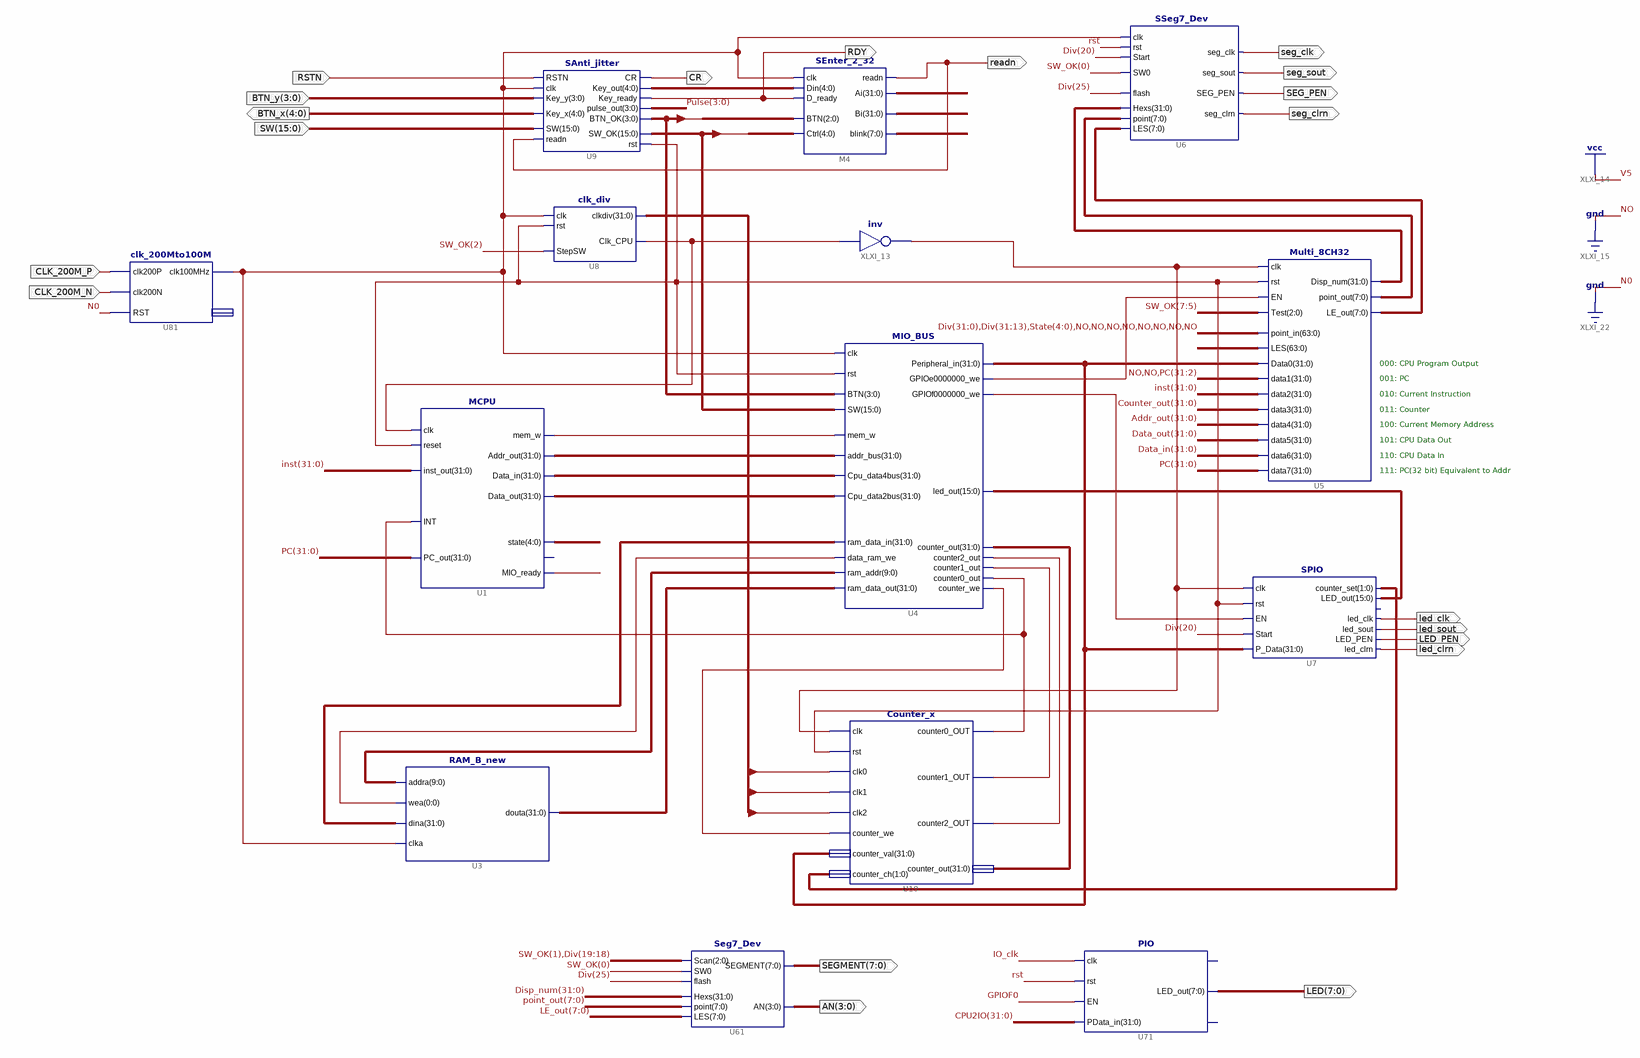
[diagram p0: schematic sheet 1]
// Xilinx ISE schematic Top_OExp09_IP2MCPU.sch (kintex7) as structural Verilog: 14 symbols, 20 ports
module Top_OExp09_IP2MCPU (
  input  RSTN,
  input  [3:0] BTN_y,
  input  [15:0] SW,
  input  CLK_200M_P,
  input  CLK_200M_N,
  output [4:0] BTN_x,
  output readn,
  output CR,
  output RDY,
  output seg_clk,
  output seg_sout,
  output SEG_PEN,
  output seg_clrn,
  output led_clk,
  output led_sout,
  output LED_PEN,
  output led_clrn,
  output [7:0] LED,
  output [7:0] SEGMENT,
  output [3:0] AN
);

  wire clk_100mhz, Clk_CPU, GPIOF0, IO_clk, rst, XLXN_54, XLXN_71, XLXN_81, XLXN_88, XLXN_92, XLXN_93;
  wire [0:0] XLXN_86;
  wire [1:0] XLXN_98;
  wire [3:0] BTN_OK, Pulse;
  wire [4:0] State, XLXN_14;
  wire [7:0] blink, LE_out, point_out;
  wire [9:0] XLXN_85;
  wire [15:0] LED_out, SW_OK;
  wire [31:0] Addr_out, Ai, Bi, Counter_out, CPU2IO, Data_in, Data_out, Disp_num, Div, inst, PC, XLXN_82,
       XLXN_87;

  Counter_x U10 (
    .clk(IO_clk), .rst(rst), .clk0(Div[8]), .clk1(Div[9]), .clk2(Div[11]), .counter_we(XLXN_88),
    .counter_val(CPU2IO), .counter_ch(XLXN_98), .counter0_OUT(XLXN_81), .counter1_OUT(XLXN_93),
    .counter2_OUT(XLXN_92), .counter_out(Counter_out));
  MCPU U1 (
    .Data_in(Data_in), .clk(Clk_CPU), .reset(rst), .MIO_ready(1'b1), .INT(XLXN_81), .state(State),
    .mem_w(XLXN_71), .inst_out(inst), .PC_out(PC), .Data_out(Data_out), .Addr_out(Addr_out));  // open: CPU_MIO
  MIO_BUS U4 (
    .rst(rst), .clk(clk_100mhz), .mem_w(XLXN_71), .addr_bus(Addr_out), .Cpu_data4bus(Data_in),
    .Cpu_data2bus(Data_out), .ram_data_out(XLXN_82), .ram_addr(XLXN_85), .data_ram_we(XLXN_86[0]),
    .ram_data_in(XLXN_87), .counter_out(Counter_out), .counter2_out(XLXN_92), .counter1_out(XLXN_93),
    .counter0_out(XLXN_81), .counter_we(XLXN_88), .BTN(BTN_OK), .SW(SW_OK), .led_out(LED_out),
    .Peripheral_in(CPU2IO), .GPIOe0000000_we(XLXN_54), .GPIOf0000000_we(GPIOF0));
  Multi_8CH32 U5 (
    .Test(SW_OK[7:5]), .point_in({Div, Div[31:13], State, {8{1'b0}}}), .EN(XLXN_54), .clk(IO_clk), .rst(rst),
    .LES({64{1'b0}}), .Data0(CPU2IO), .data1({2'b00, PC[31:2]}), .data2(inst), .data3(Counter_out),
    .data4(Addr_out), .data5(Data_out), .data6(Data_in), .data7(PC), .point_out(point_out), .LE_out(LE_out),
    .Disp_num(Disp_num));
  SAnti_jitter U9 (
    .SW(SW), .readn(readn), .Key_y(BTN_y), .Key_x(BTN_x), .RSTN(RSTN), .clk(clk_100mhz), .Key_out(XLXN_14),
    .Key_ready(RDY), .CR(CR), .rst(rst), .SW_OK(SW_OK), .pulse_out(Pulse), .BTN_OK(BTN_OK));
  clk_div U8 (.clk(clk_100mhz), .rst(rst), .Clk_CPU(Clk_CPU), .clkdiv(Div), .StepSW(SW_OK[2]));
  SEnter_2_32 M4 (
    .readn(readn), .Ai(Ai), .Bi(Bi), .blink(blink), .Din(XLXN_14), .D_ready(RDY), .clk(clk_100mhz),
    .Ctrl({SW_OK[7:5], SW_OK[15], SW_OK[0]}), .BTN(BTN_OK[2:0]));
  Seg7_Dev U61 (
    .LES(LE_out), .Scan({SW_OK[1], Div[19:18]}), .SEGMENT(SEGMENT), .AN(AN), .point(point_out),
    .flash(Div[25]), .SW0(SW_OK[0]), .Hexs(Disp_num));
  PIO U71 (.clk(IO_clk), .rst(rst), .EN(GPIOF0), .PData_in(CPU2IO), .LED_out(LED));  // open: GPIOf0, counter_set
  SSeg7_Dev U6 (
    .LES(LE_out), .SEG_PEN(SEG_PEN), .seg_sout(seg_sout), .seg_clrn(seg_clrn), .point(point_out),
    .Hexs(Disp_num), .SW0(SW_OK[0]), .flash(Div[25]), .seg_clk(seg_clk), .clk(clk_100mhz), .rst(rst),
    .Start(Div[20]));
  SPIO U7 (
    .clk(IO_clk), .P_Data(CPU2IO), .rst(rst), .EN(GPIOF0), .Start(Div[20]), .led_clk(led_clk),
    .LED_out(LED_out), .counter_set(XLXN_98), .led_clrn(led_clrn), .LED_PEN(LED_PEN), .led_sout(led_sout));  // open: GPIOf0
  not XLXI_13 (IO_clk, Clk_CPU);
  clk_200Mto100M U81 (.clk200P(CLK_200M_P), .clk200N(CLK_200M_N), .RST(1'b0), .clk100MHz(clk_100mhz));  // open: clkdiv
  RAM_B_new U3 (.addra(XLXN_85), .clka(clk_100mhz), .wea(XLXN_86[0]), .dina(XLXN_87), .douta(XLXN_82));

  // Notes on the sheet:
  //   000: CPU Program Output
  //   001: PC
  //   010: Current Instruction
  //   011: Counter
  //   100: Current Memory Address
  //   101: CPU Data Out
  //   110: CPU Data In
  //   111: PC(32 bit) Equivalent to Addr
endmodule
